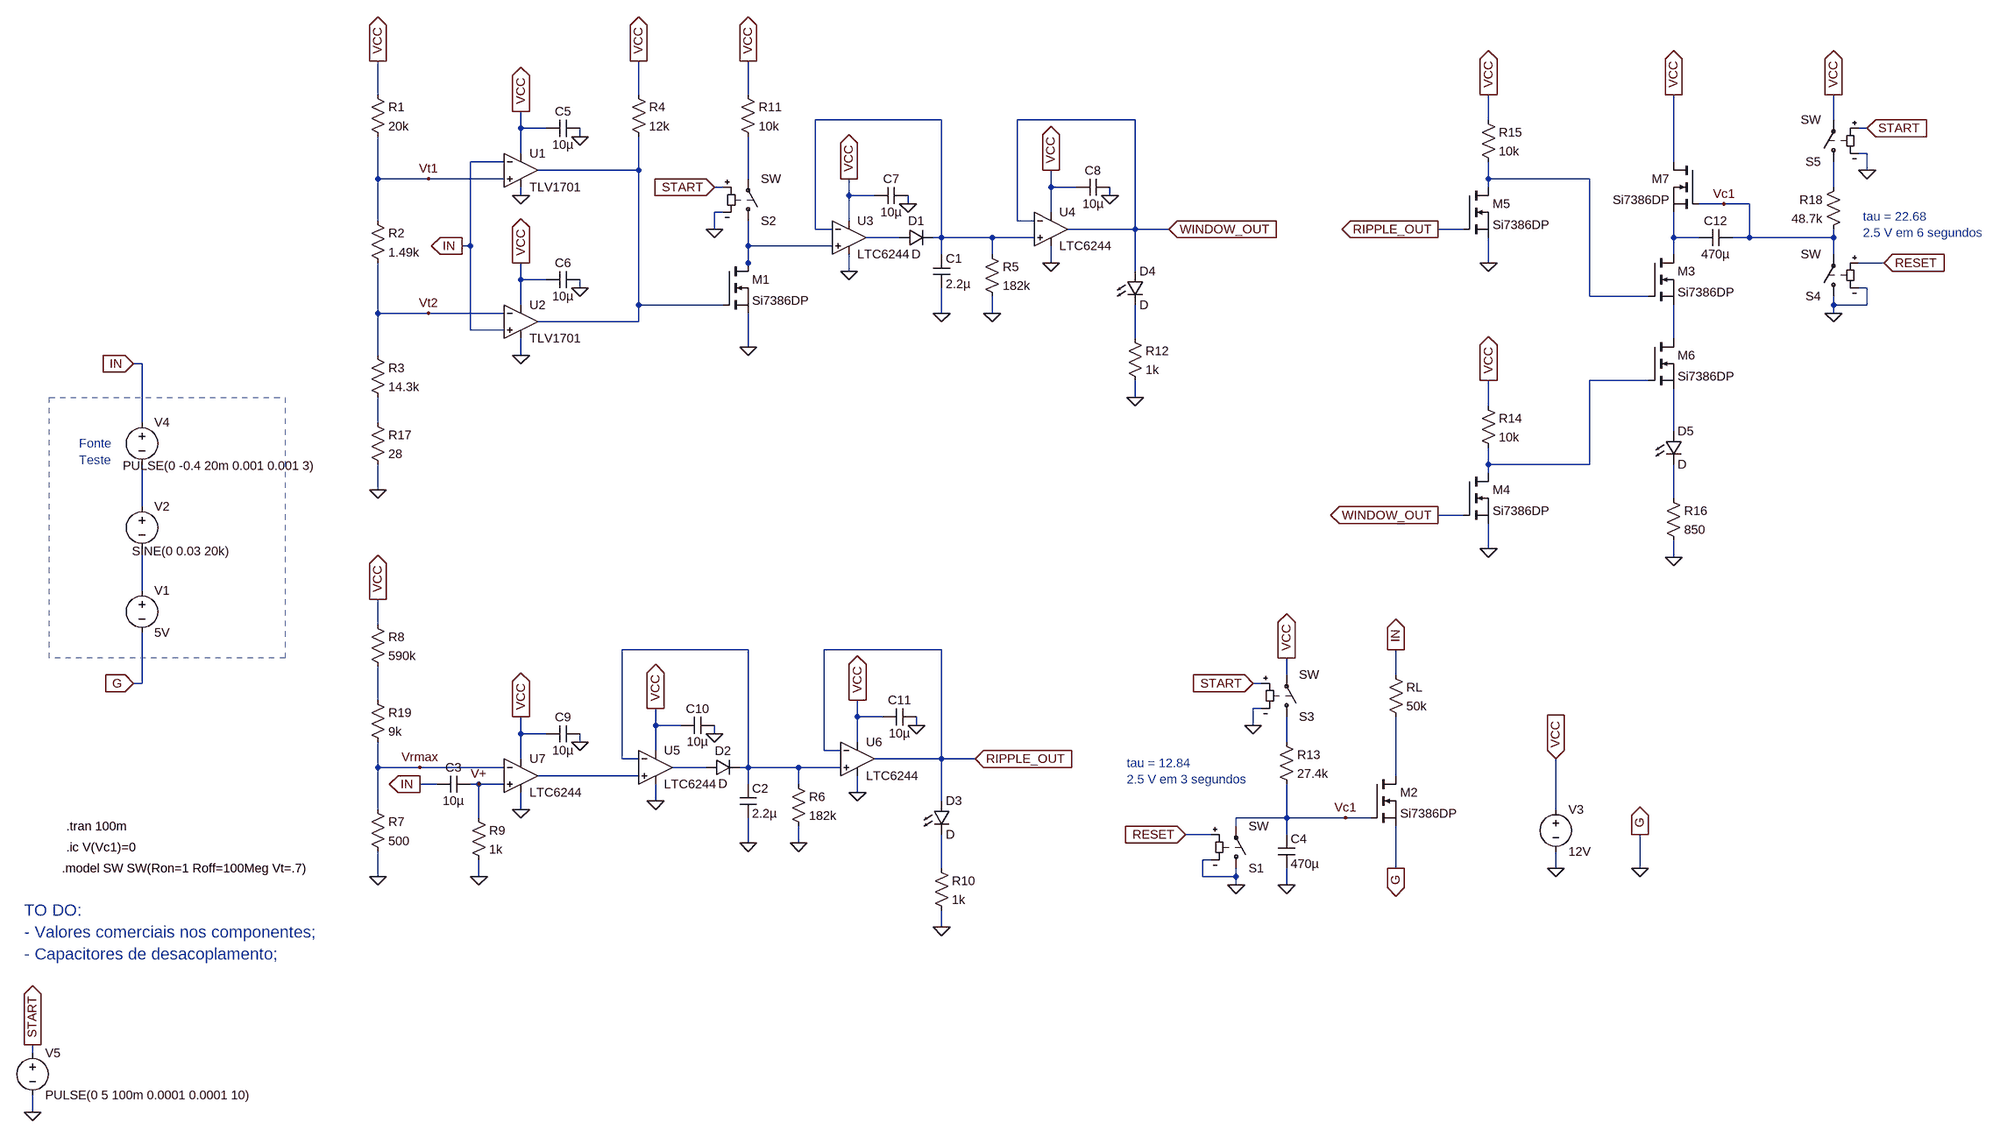
[diagram p0: schematic ProjII.asc]
ProjII.asc, the LTspice schematic file:
Version 4
SHEET 1 4124 1332
WIRE 576 -880 576 -944
WIRE 1072 -880 1072 -944
WIRE 1280 -880 1280 -944
WIRE 1648 -832 1408 -832
WIRE 2016 -832 1792 -832
WIRE 2688 -832 2688 -880
WIRE 3344 -832 3344 -880
WIRE 848 -816 848 -848
WIRE 896 -816 848 -816
WIRE 3408 -816 3392 -816
WIRE 960 -800 960 -816
WIRE 848 -768 848 -816
WIRE 3408 -768 3392 -768
WIRE 816 -752 752 -752
WIRE 3040 -752 3040 -880
WIRE 1072 -736 1072 -800
WIRE 1072 -736 880 -736
WIRE 3408 -736 3408 -768
WIRE 576 -720 576 -800
WIRE 672 -720 576 -720
WIRE 816 -720 672 -720
WIRE 1280 -720 1280 -800
WIRE 2688 -720 2688 -752
WIRE 2880 -720 2688 -720
WIRE 1232 -704 1216 -704
WIRE 1856 -704 1856 -736
WIRE 1904 -704 1856 -704
WIRE 2688 -704 2688 -720
WIRE 3344 -704 3344 -752
WIRE 848 -688 848 -704
WIRE 1472 -688 1472 -720
WIRE 1520 -688 1472 -688
WIRE 1968 -688 1968 -704
WIRE 1584 -672 1584 -688
WIRE 3136 -672 3088 -672
WIRE 3184 -672 3136 -672
WIRE 1232 -656 1216 -656
WIRE 1856 -656 1856 -704
WIRE 576 -640 576 -720
WIRE 1472 -640 1472 -688
WIRE 1792 -640 1792 -832
WIRE 1824 -640 1792 -640
WIRE 1216 -624 1216 -656
WIRE 1408 -624 1408 -832
WIRE 1440 -624 1408 -624
WIRE 2016 -624 2016 -832
WIRE 2016 -624 1888 -624
WIRE 2080 -624 2016 -624
WIRE 2640 -624 2592 -624
WIRE 1568 -608 1504 -608
WIRE 1648 -608 1648 -832
WIRE 1648 -608 1632 -608
WIRE 1744 -608 1648 -608
WIRE 1824 -608 1744 -608
WIRE 3040 -608 3040 -656
WIRE 3088 -608 3040 -608
WIRE 3184 -608 3184 -672
WIRE 3184 -608 3152 -608
WIRE 3344 -608 3344 -624
WIRE 3344 -608 3184 -608
WIRE 752 -592 752 -752
WIRE 752 -592 736 -592
WIRE 1280 -592 1280 -640
WIRE 1440 -592 1280 -592
WIRE 1648 -576 1648 -608
WIRE 1744 -576 1744 -608
WIRE 3040 -576 3040 -608
WIRE 3344 -576 3344 -608
WIRE 1280 -560 1280 -592
WIRE 1856 -560 1856 -592
WIRE 2688 -560 2688 -608
WIRE 3440 -560 3392 -560
WIRE 1280 -544 1280 -560
WIRE 1472 -544 1472 -576
WIRE 2016 -544 2016 -624
WIRE 848 -528 848 -560
WIRE 896 -528 848 -528
WIRE 960 -512 960 -528
WIRE 3408 -512 3392 -512
WIRE 2880 -496 2880 -720
WIRE 2992 -496 2880 -496
WIRE 848 -480 848 -528
WIRE 1072 -480 1072 -736
WIRE 1232 -480 1072 -480
WIRE 3344 -480 3344 -496
WIRE 3408 -480 3408 -512
WIRE 3408 -480 3344 -480
WIRE 576 -464 576 -560
WIRE 672 -464 576 -464
WIRE 816 -464 672 -464
WIRE 1648 -464 1648 -512
WIRE 1744 -464 1744 -496
WIRE 3344 -464 3344 -480
WIRE 1072 -448 1072 -480
WIRE 1072 -448 880 -448
WIRE 752 -432 752 -592
WIRE 816 -432 752 -432
WIRE 2016 -416 2016 -480
WIRE 3040 -416 3040 -480
WIRE 1280 -400 1280 -464
WIRE 576 -384 576 -464
WIRE 848 -384 848 -416
WIRE 64 -368 48 -368
WIRE 2992 -336 2880 -336
WIRE 2016 -304 2016 -336
WIRE 2688 -288 2688 -336
WIRE 64 -256 64 -368
WIRE 576 -256 576 -304
WIRE 3040 -240 3040 -320
WIRE 2688 -176 2688 -208
WIRE 2880 -176 2880 -336
WIRE 2880 -176 2688 -176
WIRE 2688 -160 2688 -176
WIRE 576 -128 576 -176
WIRE 3040 -112 3040 -176
WIRE 64 -96 64 -176
WIRE 2640 -80 2592 -80
WIRE 2688 -16 2688 -64
WIRE 3040 0 3040 -32
WIRE 64 64 64 -16
WIRE 576 128 576 80
WIRE 1280 176 1040 176
WIRE 1648 176 1424 176
WIRE 2304 224 2304 192
WIRE 2512 224 2512 176
WIRE 64 240 64 144
WIRE 64 240 48 240
WIRE 2256 240 2240 240
WIRE 576 272 576 208
WIRE 2256 288 2240 288
WIRE 1488 304 1488 272
WIRE 1536 304 1488 304
WIRE 1104 320 1104 288
WIRE 1152 320 1104 320
WIRE 1600 320 1600 304
WIRE 2240 320 2240 288
WIRE 848 336 848 304
WIRE 896 336 848 336
WIRE 1216 336 1216 320
WIRE 960 352 960 336
WIRE 1488 352 1488 304
WIRE 2304 352 2304 304
WIRE 1104 368 1104 320
WIRE 1424 368 1424 176
WIRE 1456 368 1424 368
WIRE 848 384 848 336
WIRE 1040 384 1040 176
WIRE 1072 384 1040 384
WIRE 1648 384 1648 176
WIRE 1648 384 1520 384
WIRE 1712 384 1648 384
WIRE 576 400 576 352
WIRE 656 400 576 400
WIRE 816 400 656 400
WIRE 1200 400 1136 400
WIRE 1280 400 1280 176
WIRE 1280 400 1264 400
WIRE 1376 400 1280 400
WIRE 1456 400 1376 400
WIRE 1072 416 880 416
WIRE 2512 416 2512 304
WIRE 688 432 656 432
WIRE 768 432 752 432
WIRE 816 432 768 432
WIRE 1280 432 1280 400
WIRE 1376 432 1376 400
WIRE 1488 448 1488 416
WIRE 1104 464 1104 432
WIRE 1648 464 1648 384
WIRE 576 480 576 400
WIRE 848 480 848 448
WIRE 2816 480 2816 384
WIRE 768 496 768 432
WIRE 2304 496 2304 432
WIRE 2304 496 2208 496
WIRE 2416 496 2304 496
WIRE 2464 496 2416 496
WIRE 2208 512 2208 496
WIRE 2160 528 2112 528
WIRE 2304 528 2304 496
WIRE 1280 544 1280 496
WIRE 1376 544 1376 512
WIRE 2160 576 2144 576
WIRE 1648 592 1648 528
WIRE 2512 592 2512 512
WIRE 2816 592 2816 560
WIRE 2976 592 2976 528
WIRE 576 608 576 560
WIRE 768 608 768 576
WIRE 2144 608 2144 576
WIRE 2208 608 2208 592
WIRE 2208 608 2144 608
WIRE 2208 624 2208 608
WIRE 2304 624 2304 592
WIRE 1648 704 1648 672
WIRE -144 944 -144 928
WIRE -144 1056 -144 1024
FLAG 2816 592 0
FLAG 2976 528 G
IOPIN 2976 528 Out
FLAG 2976 592 0
FLAG 2816 384 VCC
IOPIN 2816 384 In
FLAG 2304 192 VCC
IOPIN 2304 192 Out
FLAG 2512 176 IN
IOPIN 2512 176 Out
FLAG 2512 592 G
IOPIN 2512 592 Out
FLAG 2304 624 0
FLAG 2112 528 RESET
IOPIN 2112 528 In
FLAG 2208 624 0
FLAG -144 1056 0
FLAG -144 928 START
IOPIN -144 928 Out
FLAG 2416 496 Vc1
FLAG 848 -384 0
FLAG 576 -128 0
FLAG 848 -688 0
FLAG 576 -944 VCC
IOPIN 576 -944 Out
FLAG 1072 -944 VCC
IOPIN 1072 -944 Out
FLAG 848 -848 VCC
IOPIN 848 -848 Out
FLAG 736 -592 IN
IOPIN 736 -592 Out
FLAG 1648 -464 0
FLAG 1744 -464 0
FLAG 1472 -544 0
FLAG 1856 -560 0
FLAG 1280 -400 0
FLAG 1280 -944 VCC
IOPIN 1280 -944 Out
FLAG 2016 -304 0
FLAG 960 -800 0
FLAG 848 -560 VCC
IOPIN 848 -560 Out
FLAG 960 -512 0
FLAG 1472 -720 VCC
IOPIN 1472 -720 Out
FLAG 1584 -672 0
FLAG 1856 -736 VCC
IOPIN 1856 -736 Out
FLAG 1968 -688 0
FLAG 2080 -624 WINDOW_OUT
IOPIN 2080 -624 In
FLAG 1216 -704 START
IOPIN 1216 -704 In
FLAG 1216 -624 0
FLAG 672 -720 Vt1
FLAG 672 -464 Vt2
FLAG 48 -368 IN
IOPIN 48 -368 In
FLAG 48 240 G
IOPIN 48 240 In
FLAG 2240 240 START
IOPIN 2240 240 In
FLAG 2240 320 0
FLAG 1280 544 0
FLAG 1376 544 0
FLAG 1104 464 0
FLAG 1488 448 0
FLAG 576 608 0
FLAG 576 80 VCC
IOPIN 576 80 Out
FLAG 656 432 IN
IOPIN 656 432 Out
FLAG 768 608 0
FLAG 848 480 0
FLAG 1648 704 0
FLAG 848 304 VCC
IOPIN 848 304 Out
FLAG 960 352 0
FLAG 1104 288 VCC
IOPIN 1104 288 Out
FLAG 1216 336 0
FLAG 1488 272 VCC
IOPIN 1488 272 Out
FLAG 1600 320 0
FLAG 1712 384 RIPPLE_OUT
IOPIN 1712 384 In
FLAG 656 400 Vrmax
FLAG 768 432 V+
FLAG 2592 -80 WINDOW_OUT
IOPIN 2592 -80 Out
FLAG 2592 -624 RIPPLE_OUT
IOPIN 2592 -624 Out
FLAG 2688 -336 VCC
IOPIN 2688 -336 Out
FLAG 2688 -16 0
FLAG 2688 -880 VCC
IOPIN 2688 -880 Out
FLAG 2688 -560 0
FLAG 3040 0 0
FLAG 3344 -464 0
FLAG 3136 -672 Vc1
FLAG 3040 -880 VCC
IOPIN 3040 -880 Out
FLAG 3344 -880 VCC
IOPIN 3344 -880 Out
FLAG 3408 -816 START
IOPIN 3408 -816 In
FLAG 3408 -736 0
FLAG 3440 -560 RESET
IOPIN 3440 -560 In
SYMBOL voltage 2816 464 R0
SYMATTR InstName V3
SYMATTR Value 12V
SYMBOL res 2288 336 R0
SYMATTR InstName R13
SYMATTR Value 27.4k
SYMBOL cap 2288 528 R0
SYMATTR InstName C4
SYMATTR Value 470µ
SYMBOL nmos 2464 416 R0
SYMATTR InstName M2
SYMATTR Value Si7386DP
SYMBOL res 2496 208 R0
SYMATTR InstName RL
SYMATTR Value 50k
SYMBOL sw 2208 608 M180
SYMATTR InstName S1
SYMBOL voltage -144 928 R0
WINDOW 123 0 0 Left 0
WINDOW 39 0 0 Left 0
SYMATTR InstName V5
SYMATTR Value PULSE(0 5 100m 0.0001 0.0001 10)
SYMBOL res 560 -896 R0
SYMATTR InstName R1
SYMATTR Value 20k
SYMBOL res 560 -656 R0
SYMATTR InstName R2
SYMATTR Value 1.49k
SYMBOL res 560 -400 R0
SYMATTR InstName R3
SYMATTR Value 14.3k
SYMBOL AutoGenerated\\TLV1701 848 -736 R0
SYMATTR InstName U1
SYMBOL AutoGenerated\\TLV1701 848 -448 R0
SYMATTR InstName U2
SYMBOL res 1056 -896 R0
SYMATTR InstName R4
SYMATTR Value 12k
SYMBOL OpAmps\\LTC6244 1472 -608 R0
SYMATTR InstName U3
SYMBOL diode 1568 -592 R270
WINDOW 0 32 32 VTop 2
WINDOW 3 0 32 VBottom 2
SYMATTR InstName D1
SYMBOL cap 1632 -576 R0
SYMATTR InstName C1
SYMATTR Value 2.2µ
SYMBOL res 1728 -592 R0
SYMATTR InstName R5
SYMATTR Value 182k
SYMBOL OpAmps\\LTC6244 1856 -624 R0
SYMATTR InstName U4
SYMBOL nmos 1232 -560 R0
SYMATTR InstName M1
SYMATTR Value Si7386DP
SYMBOL res 1264 -896 R0
SYMATTR InstName R11
SYMATTR Value 10k
SYMBOL LED 2000 -544 R0
SYMATTR InstName D4
SYMBOL res 2000 -432 R0
SYMATTR InstName R12
SYMATTR Value 1k
SYMBOL cap 960 -832 R90
WINDOW 0 0 32 VBottom 2
WINDOW 3 32 32 VTop 2
SYMATTR InstName C5
SYMATTR Value 10µ
SYMBOL cap 960 -544 R90
WINDOW 0 0 32 VBottom 2
WINDOW 3 32 32 VTop 2
SYMATTR InstName C6
SYMATTR Value 10µ
SYMBOL cap 1584 -704 R90
WINDOW 0 0 32 VBottom 2
WINDOW 3 32 32 VTop 2
SYMATTR InstName C7
SYMATTR Value 10µ
SYMBOL cap 1968 -720 R90
WINDOW 0 0 32 VBottom 2
WINDOW 3 32 32 VTop 2
SYMATTR InstName C8
SYMATTR Value 10µ
SYMBOL sw 1280 -624 M180
SYMATTR InstName S2
SYMBOL res 560 -272 R0
SYMATTR InstName R17
SYMATTR Value 28
SYMBOL voltage 64 48 R0
SYMATTR InstName V1
SYMATTR Value 5V
SYMBOL voltage 64 -112 R0
WINDOW 123 0 0 Left 0
WINDOW 39 0 0 Left 0
WINDOW 3 -19 101 Left 2
SYMATTR Value SINE(0 0.03 20k)
SYMATTR InstName V2
SYMBOL voltage 64 -272 R0
WINDOW 3 -36 98 Left 2
WINDOW 123 0 0 Left 0
WINDOW 39 0 0 Left 0
SYMATTR Value PULSE(0 -0.4 20m 0.001 0.001 3)
SYMATTR InstName V4
SYMBOL sw 2304 320 M180
SYMATTR InstName S3
SYMBOL OpAmps\\LTC6244 1104 400 R0
SYMATTR InstName U5
SYMBOL diode 1200 416 R270
WINDOW 0 32 32 VTop 2
WINDOW 3 0 32 VBottom 2
SYMATTR InstName D2
SYMBOL cap 1264 432 R0
SYMATTR InstName C2
SYMATTR Value 2.2µ
SYMBOL res 1360 416 R0
SYMATTR InstName R6
SYMATTR Value 182k
SYMBOL OpAmps\\LTC6244 1488 384 R0
SYMATTR InstName U6
SYMBOL res 560 464 R0
SYMATTR InstName R7
SYMATTR Value 500
SYMBOL res 560 112 R0
SYMATTR InstName R8
SYMATTR Value 590k
SYMBOL cap 752 416 R90
WINDOW 0 0 32 VBottom 2
WINDOW 3 32 32 VTop 2
SYMATTR InstName C3
SYMATTR Value 10µ
SYMBOL res 752 480 R0
SYMATTR InstName R9
SYMATTR Value 1k
SYMBOL LED 1632 464 R0
SYMATTR InstName D3
SYMBOL OpAmps\\LTC6244 848 416 R0
SYMATTR InstName U7
SYMBOL res 1632 576 R0
SYMATTR InstName R10
SYMATTR Value 1k
SYMBOL cap 960 320 R90
WINDOW 0 0 32 VBottom 2
WINDOW 3 32 32 VTop 2
SYMATTR InstName C9
SYMATTR Value 10µ
SYMBOL cap 1216 304 R90
WINDOW 0 0 32 VBottom 2
WINDOW 3 32 32 VTop 2
SYMATTR InstName C10
SYMATTR Value 10µ
SYMBOL cap 1600 288 R90
WINDOW 0 0 32 VBottom 2
WINDOW 3 32 32 VTop 2
SYMATTR InstName C11
SYMATTR Value 10µ
SYMBOL res 560 256 R0
SYMATTR InstName R19
SYMATTR Value 9k
SYMBOL nmos 2992 -576 R0
SYMATTR InstName M3
SYMATTR Value Si7386DP
SYMBOL nmos 2640 -160 R0
SYMATTR InstName M4
SYMATTR Value Si7386DP
SYMBOL res 2672 -304 R0
SYMATTR InstName R14
SYMATTR Value 10k
SYMBOL nmos 2640 -704 R0
SYMATTR InstName M5
SYMATTR Value Si7386DP
SYMBOL res 2672 -848 R0
SYMATTR InstName R15
SYMATTR Value 10k
SYMBOL nmos 2992 -416 R0
SYMATTR InstName M6
SYMATTR Value Si7386DP
SYMBOL LED 3024 -240 R0
SYMATTR InstName D5
SYMBOL res 3024 -128 R0
SYMATTR InstName R16
SYMATTR Value 850
SYMBOL res 3360 -720 M0
SYMATTR InstName R18
SYMATTR Value 48.7k
SYMBOL cap 3152 -592 M270
WINDOW 0 32 32 VTop 2
WINDOW 3 0 32 VBottom 2
SYMATTR InstName C12
SYMATTR Value 470µ
SYMBOL nmos 3088 -752 M0
SYMATTR InstName M7
SYMATTR Value Si7386DP
SYMBOL sw 3344 -480 R180
SYMATTR InstName S4
SYMBOL sw 3344 -736 R180
SYMATTR InstName S5
TEXT -80 512 Left 2 !.tran 100m
TEXT -160 672 Left 3 ;TO DO:\n- Valores comerciais nos componentes;\n- Capacitores de desacoplamento;
TEXT -88 592 Left 2 !.model SW SW(Ron=1 Roff=100Meg Vt=.7)
TEXT -80 552 Left 2 !.ic V(Vc1)=0
TEXT -56 -216 Left 2 ;Fonte\nTeste
TEXT 2000 392 Left 2 ;tau = 12.84\n2.5 V em 3 segundos
TEXT 3400 -648 Left 2 ;tau = 22.68\n2.5 V em 6 segundos
RECTANGLE Normal -112 -304 336 192 2

The netlist it stands for:
* ProjII.asc
V3 VCC 0 12V
R13 N019 Vc1 27.4k
C4 Vc1 0 470µ
M2 N022 Vc1 0 0 Si7386DP
RL IN N022 50k
S1 0 Vc1 RESET 0 SW
V5 START 0 PULSE(0 5 100m 0.0001 0.0001 10)
R1 VCC Vt1 20k
R2 Vt1 Vt2 1.49k
R3 Vt2 N012 14.3k
* U1: TLV1701 (symbol AutoGenerated\TLV1701 not available, pins judged from their places): In+=Vt1 In-=IN V+=VCC V-=0 OUT=N002
* U2: TLV1701 (symbol AutoGenerated\TLV1701 not available, pins judged from their places): In+=IN In-=Vt2 V+=VCC V-=0 OUT=N002
R4 VCC N002 12k
XU3 N008 N001 VCC 0 N006 LTC6244  ; pins In+ In- V+ V- OUT
D1 N006 N001 D
C1 N001 0 2.2µ
R5 N001 0 182k
XU4 N001 WINDOW_OUT VCC 0 WINDOW_OUT LTC6244  ; pins In+ In- V+ V- OUT
M1 N008 N002 0 0 Si7386DP
R11 VCC N003 10k
D4 WINDOW_OUT N009 D
R12 N009 0 1k
C5 0 VCC 10µ
C6 0 VCC 10µ
C7 0 VCC 10µ
C8 0 VCC 10µ
S2 N008 N003 START 0 SW
R17 N012 0 28
V1 N016 0 5V
V2 N015 N016 SINE(0 0.03 20k)
V4 IN N015 PULSE(0 -0.4 20m 0.001 0.001 3)
S3 N019 VCC START 0 SW
XU5 N021 N017 VCC 0 N020 LTC6244  ; pins In+ In- V+ V- OUT
D2 N020 N017 D
C2 N017 0 2.2µ
R6 N017 0 182k
XU6 N017 RIPPLE_OUT VCC 0 RIPPLE_OUT LTC6244  ; pins In+ In- V+ V- OUT
R7 Vrmax 0 500
R8 VCC N018 590k
C3 V+ IN 10µ
R9 V+ 0 1k
D3 RIPPLE_OUT N023 D
XU7 V+ Vrmax VCC 0 N021 LTC6244  ; pins In+ In- V+ V- OUT
R10 N023 0 1k
C9 0 VCC 10µ
C10 0 VCC 10µ
C11 0 VCC 10µ
R19 N018 Vrmax 9k
M3 N007 N004 N010 N010 Si7386DP
M4 N011 WINDOW_OUT 0 0 Si7386DP
R14 VCC N011 10k
M5 N004 RIPPLE_OUT 0 0 Si7386DP
R15 VCC N004 10k
M6 N010 N011 N013 N013 Si7386DP
D5 N013 N014 D
R16 N014 0 850
R18 N005 Vc1 48.7k
C12 Vc1 N007 470µ
M7 VCC Vc1 N007 N007 Si7386DP
S4 0 Vc1 RESET 0 SW
S5 N005 VCC START 0 SW
.model D D
.lib standard.dio
.model NMOS NMOS
.model PMOS PMOS
.lib standard.mos
.tran 100m
* TO DO:
* - Valores comerciais nos componentes;
* - Capacitores de desacoplamento;
.model SW SW(Ron=1 Roff=100Meg Vt=.7)
.ic V(Vc1)=0
* Fonte
* Teste
* tau = 12.84
* 2.5 V em 3 segundos
* tau = 22.68
* 2.5 V em 6 segundos
.backanno
.end